# Altium schematic sheet mmc5983ma.SchDoc
size A4; SheetNumber: 10; SheetTotal: 11
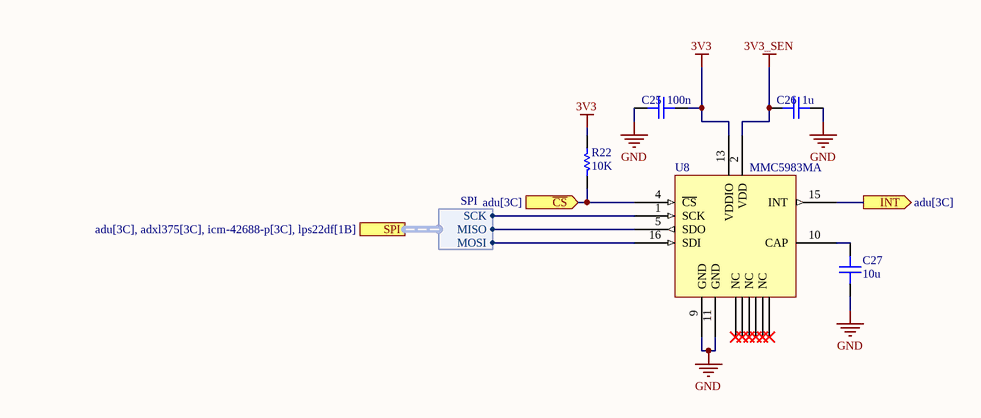
[diagram p0: mmc5983ma.SchDoc]

## Parts
C25  100n  [CAP-0603-NP]
C26  1u  [CAP-0603-NP]
C27  10u  [CAP-0603-NP]
R22  10K  [RES-0603]
U8  MMC5983MA  [MMC5983MA]

## Ports
INT (out, see adu[3C]), SPI (harness SPI, see adu[3C], adxl375[3C], icm-42688-p[3C], lps22df[1B]), ~{CS} (in, see adu[3C])

## Harnesses
SPI: MISO, MOSI, SCK

## Nets
3V3: C25.2 R22.2 U8.13(VDDIO)
3V3_SEN: C26.1 U8.2(VDD)
GND: C25.1 C26.2 C27.1 U8.9(GND) U8.11(GND)
~{CS}: R22.1 U8.4(~{CS}) ; port ~{CS}
INT: U8.15(INT) ; port INT
NetC27_2: C27.2 U8.10(CAP)
NetU8_1: U8.1(SCK) ; port SPI.SCK
NetU8_5: U8.5(SDO) ; port SPI.MISO
NetU8_16: U8.16(SDI) ; port SPI.MOSI

Not connected (* = marked no-connect by the designer): U8 3(NC)* 6(NC)* 7(NC)* 8(NC)* 12(NC)* 14(NC)*

## Library data of the parts
C25-C27 = Capacitor
R22 = Resistor
U8 = MMC5983MA: ±8 Gauss, High Performance / 3-axis Magnetic Sensor